# EAGLE design rf-power (EAGLE 6.2)
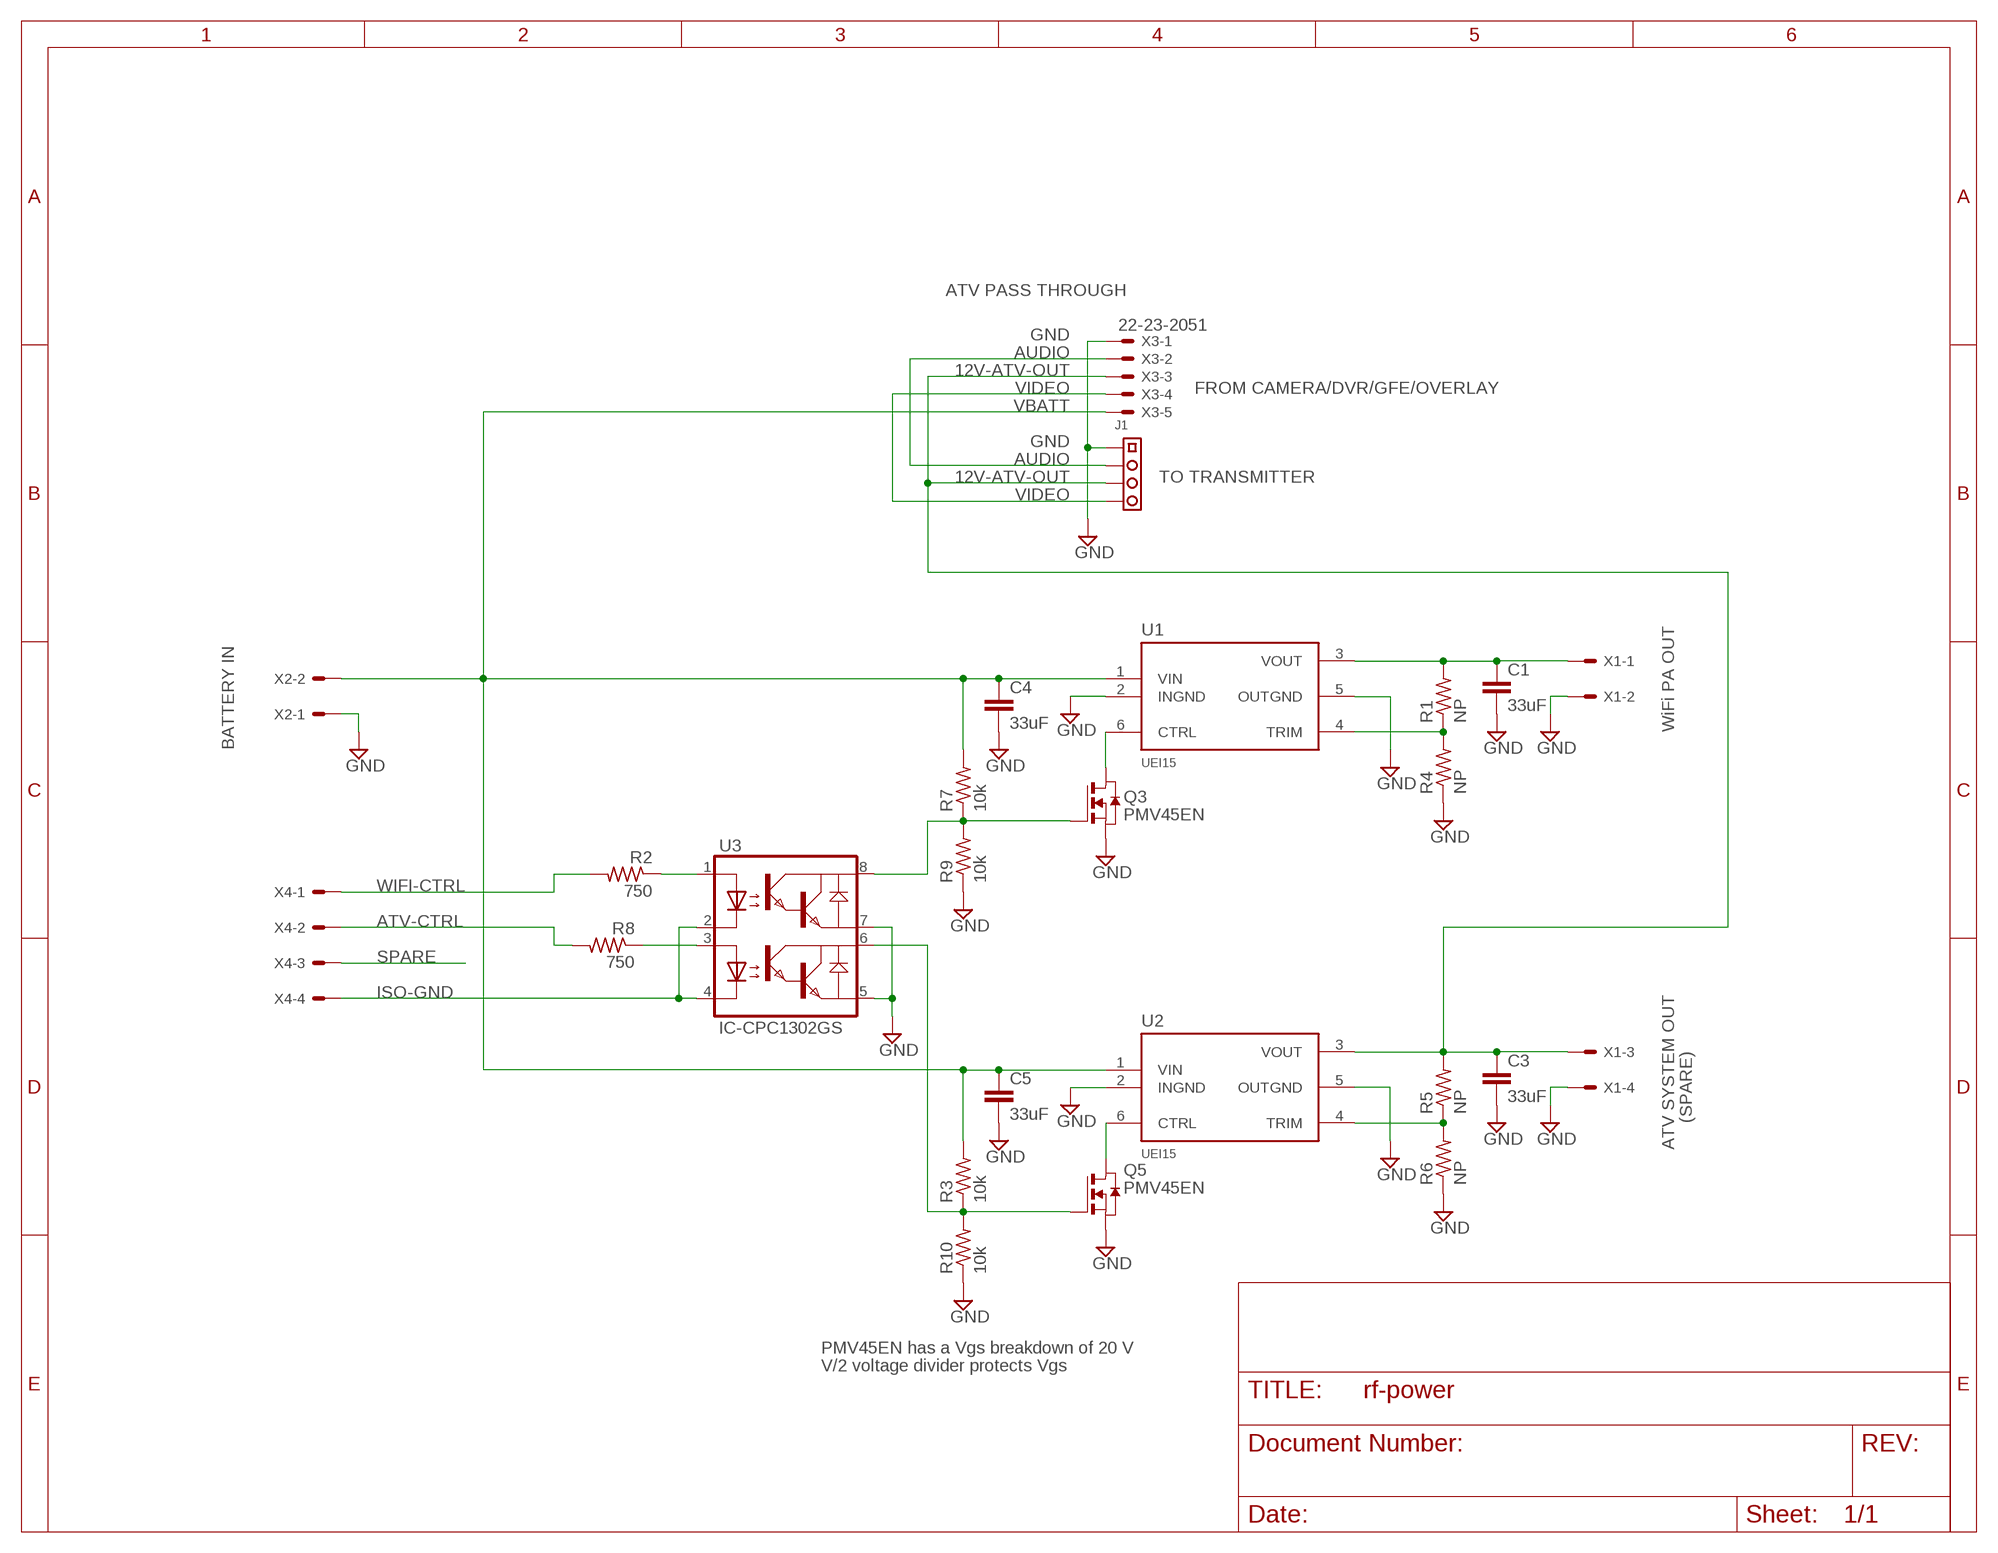
[diagram p0: schematic, sheet 1]

## Parts
C1  33uF  C-EU1206-B  [1206-B]
C3  33uF  C-EU1206-B  [1206-B]
C4  33uF  C-EU1206-B  [1206-B]
C5  33uF  C-EU1206-B  [1206-B]
J1  CON-2MM-4X1  [2MM-4X1]
Q3  PMV45EN  [SOT23]
Q5  PMV45EN  [SOT23]
R1  NP  R-US_0805-C-NOSILK  [0805-C-NOSILK]
R2  750  R-US_0805-C-NOSILK  [0805-C-NOSILK]
R3  10k  R-US_0805-C-NOSILK  [0805-C-NOSILK]
R4  NP  R-US_0805-C-NOSILK  [0805-C-NOSILK]
R5  NP  R-US_0805-C-NOSILK  [0805-C-NOSILK]
R6  NP  R-US_0805-C-NOSILK  [0805-C-NOSILK]
R7  10k  R-US_0805-C-NOSILK  [0805-C-NOSILK]
R8  750  R-US_0805-C-NOSILK  [0805-C-NOSILK]
R9  10k  R-US_0805-C-NOSILK  [0805-C-NOSILK]
R10  10k  R-US_0805-C-NOSILK  [0805-C-NOSILK]
U1  UEI15  [UEI15_PIN]
U2  UEI15  [UEI15_PIN]
U3  IC-CPC1302GS  [DIL-SMT-8]
X1  22-23-2041  [22-23-2041]
X2  22-23-2021  [22-23-2021]
X3  22-23-2051  [22-23-2051]
X4  22-23-2041  [22-23-2041]

## Nets
12V-ATV-OUT: C3.1 J1.3 R5.2 U2.3(VOUT) X1.3 X3.3
12V-WIFI-OUT: C1.1 R1.2 U1.3(VOUT) X1.1
ATV-CTRL: R8.2 X4.2
AUDIO: J1.2 X3.2
GND: C1.2 C3.2 C4.2 C5.2 J1.1 Q3.2(S) Q5.2(S) R4.1 R6.1 R9.1 R10.1 U1.2(INGND) U1.5(OUTGND) U2.2(INGND) U2.5(OUTGND) U3.5(E2) U3.7(E1) X1.2 X1.4 X2.1 X3.1
ISO-GND: U3.2(K1) U3.4(K2) X4.4
N$1: R8.1 U3.3(A2)
N$2: Q5.3(D) U2.6(CTRL)
N$3: R1.1 R4.2 U1.4(TRIM)
N$4: R5.1 R6.2 U2.4(TRIM)
N$5: Q3.3(D) U1.6(CTRL)
N$6: Q3.1(G) R7.1 R9.2 U3.8(C1)
N$7: R2.1 U3.1(A1)
N$8: Q5.1(G) R3.1 R10.2 U3.6(C2)
SPARE: X4.3
VBATT: C4.1 C5.1 R3.2 R7.2 U1.1(VIN) U2.1(VIN) X2.2 X3.5
VIDEO: J1.4 X3.4
WIFI-CTRL: R2.2 X4.1

## Notes on the sheet
- ATV PASS THROUGH
- FROM CAMERA/DVR/GFE/OVERLAY
- TO TRANSMITTER
- WiFi PA OUT
- BATTERY IN
- (SPARE)
- ATV SYSTEM OUT
- PMV45EN has a Vgs breakdown of 20 V
- V/2 voltage divider protects Vgs

## Library data of the parts
C1 C3-C5 = rcl_custom:C-EU: CAPACITOR, European symbol
J1 = 2mmx4:CON-2MM-4X1
Q3 Q5 = Tova:PMV45EN
R1-R10 = rcl_custom:R-US_: RESISTOR, American symbol
U1 U2 = UEI15:UEI15: Isolated Wide Input Range 15-Watt DC/DC Converter
U3 = Tova:IC-CPC1302GS
X1 X4 = con-molex:22-23-2041: .100" (2.54mm) Center Header - 4 Pin; MF: MOLEX; MPN: 22-23-2041; OC_FARNELL: 1462920; OC_NEWARK: 38C0355
X2 = con-molex:22-23-2021: .100" (2.54mm) Center Header - 2 Pin; MF: MOLEX; MPN: 22-23-2021; OC_FARNELL: 1462926; OC_NEWARK: 25C3832
X3 = con-molex:22-23-2051: .100" (2.54mm) Center Header - 5 Pin; MF: MOLEX; MPN: 22-23-2051; OC_FARNELL: 1462952; OC_NEWARK: 38C9178

## Board
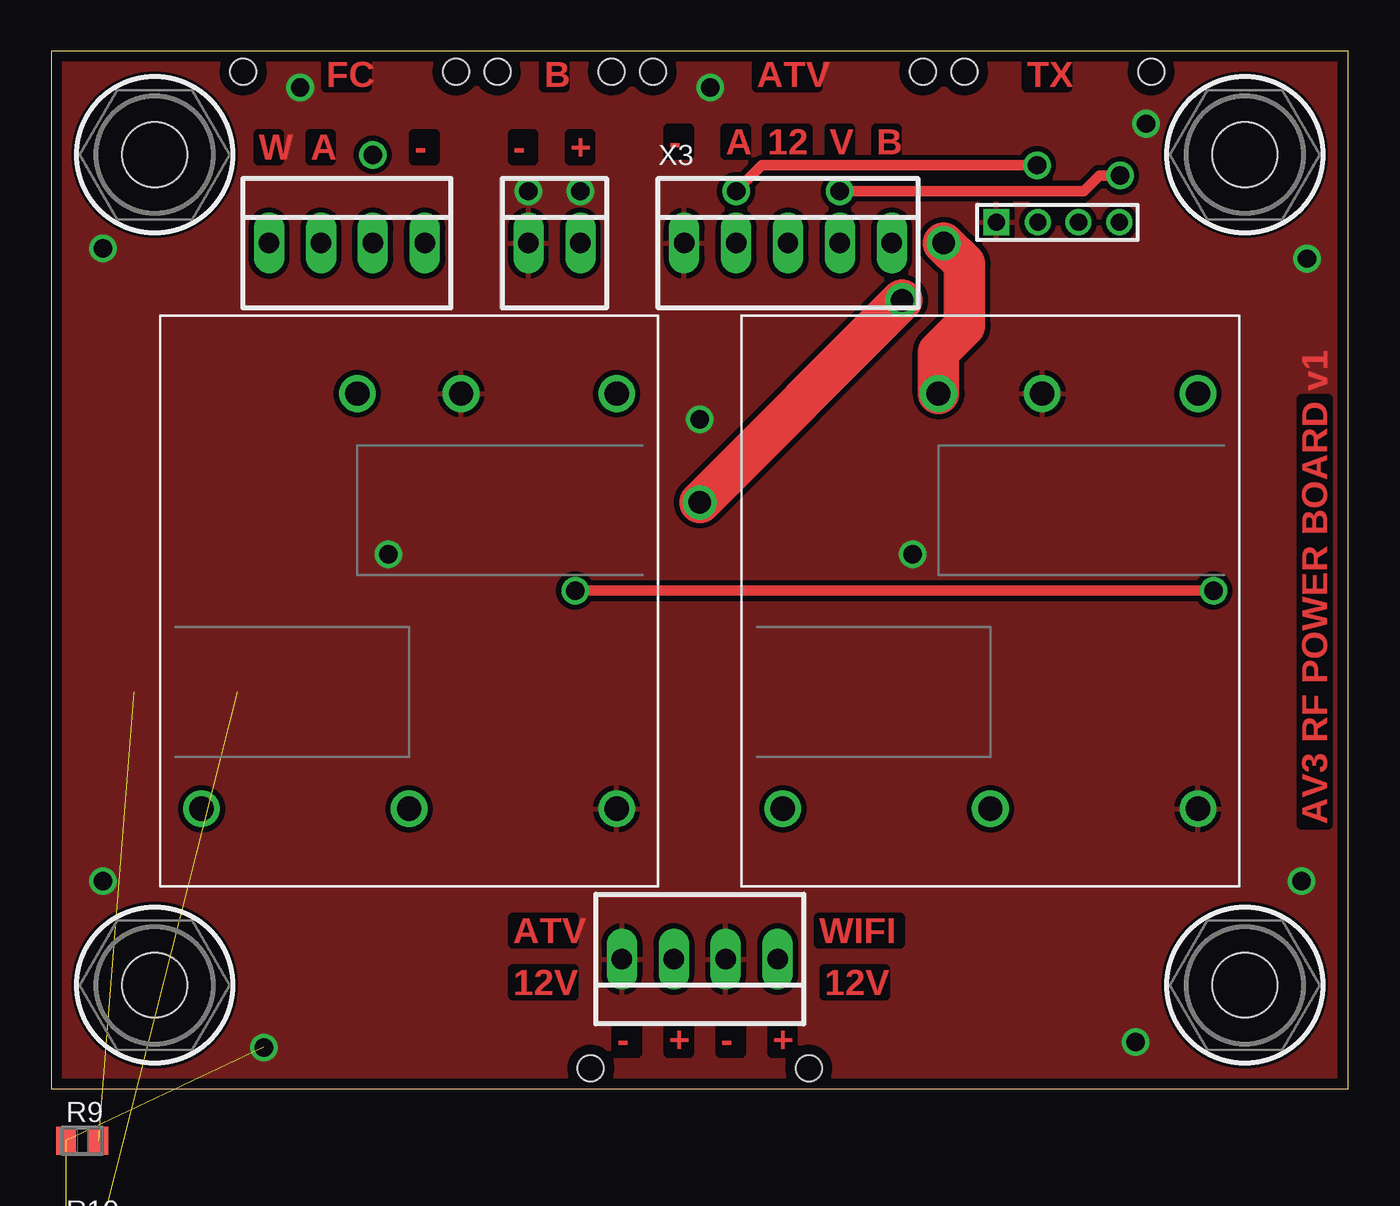
[diagram p1: board, top side]
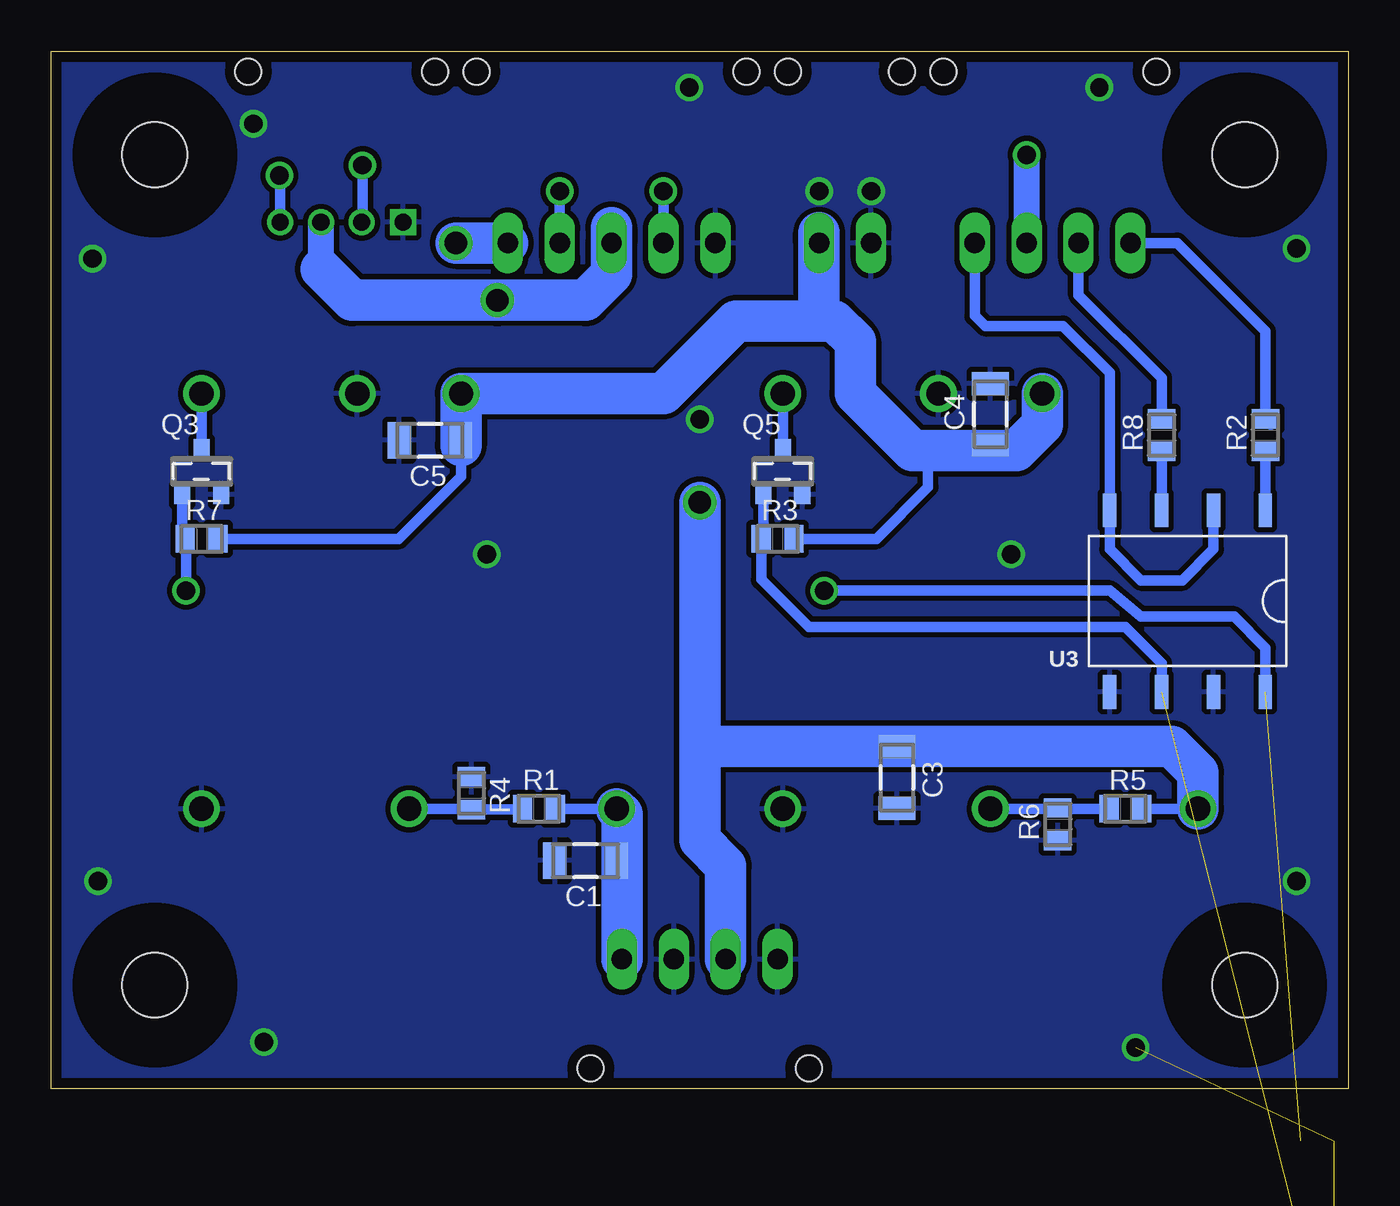
[diagram p2: board, bottom side, seen from below]

Size 63.5 x 50.8 mm. Coordinates in mm from the lower left corner, seen from the top.
Outline: 0,0 63.5,0 63.5,50.8 0,50.8 0,0
Copper layers (1*16): Top 0.0178mm / dielectric 59mil / Bottom 0.0178mm
Design rules: minimum track width 6mil, minimum drill 14mil, track to track 6mil, track to pad 6mil, pad to pad 6mil, via to via 6mil, smd to smd 6mil, copper to edge 20mil, drill to drill 16mil, minimum pad ring 8mil, minimum via ring 8mil, stop-mask expansion 3mil, vias tented up to drill 0mil, thermal gap 10mil
Holes 1.27 mm at 9.4,49.78 19.81,49.78 21.84,49.78 27.43,49.78 29.46,49.78 42.67,49.78 44.7,49.78 53.85,49.78 26.42,1.02 37.08,1.02
bRestrict: area 1.4,1.4 to 8.7,8.7; area 54.8,1.4 to 62.1,8.7; area 54.8,42.1 to 62.1,49.4; area 1.4,42.1 to 8.7,49.4

### Footprints (pad centres in the part's own frame; a part is rotated, then mirrored left to right if it is on the bottom)
1206-B = smd 1.15 x 1.8: 1 -1.5,0; 2 1.5,0
2MM-4X1 = drill 0.838 pad 1.27 square: 1 0,4.03 | drill 0.838 pad 1.27: 2 0,2; 3 0,0; 4 0,-2
SOT23 = smd 0.787 x 0.889: 1 -0.953,-1.143; 2 0.953,-1.143; 3 0,1.143
0805-C-NOSILK = smd 0.95 x 1.35: 1 -0.8,0; 2 0.8,0
UEI15_PIN = drill 1.194: 1 -10.16,-2.54; 2 -10.16,2.54; 3 10.16,-10.16; 4 10.16,0; 5 10.16,10.16; 6 -10.16,10.16
DIL-SMT-8 = smd 0.648 x 1.648: 1 -3.81,-4.449; 2 -1.27,-4.449; 3 1.27,-4.449; 4 3.81,-4.449; 5 3.81,4.449; 6 1.27,4.449; 7 -1.27,4.449; 8 -3.81,4.449
#4/.300-BARE+STD_NUT_OR_STAR_WASHER = hole 3.175: 0,0
22-23-2041 = drill 1 long: 1 -3.81,0; 2 -1.27,0; 3 1.27,0; 4 3.81,0
22-23-2021 = drill 1 long: 1 -1.27,0; 2 1.27,0
22-23-2051 = drill 1 long: 1 -5.08,0; 2 -2.54,0; 3 0,0; 4 2.54,0; 5 5.08,0

### Placement (x,y rotation side)
C1  37.34,11.18 180 bottom
C3  22.1,15.24 270 bottom
C4  17.53,33.02 90 bottom
C5  44.96,31.75 180 bottom
J1  50.29,42.42 90 top
Q3  56.13,30.23 0 bottom
Q5  27.69,30.23 0 bottom
R1  39.62,13.72 0 bottom
R2  4.06,32 90 bottom
R3  27.94,26.92 0 bottom
R4  42.93,14.48 270 bottom
R5  10.92,13.72 0 bottom
R6  14.22,12.95 90 bottom
R7  56.13,26.92 0 bottom
R8  9.14,32 90 bottom
R9  1.52,-2.54 0 top
R10  1.52,-7.37 0 top  (outside the outline)
U1  45.97,23.88 270 top
U2  17.53,23.88 270 top
U3  7.87,23.88 180 bottom
U$1  [#4/.300-BARE+STD_NUT_OR_STAR_WASHER]  5.08,45.72 0 top
U$2  [#4/.300-BARE+STD_NUT_OR_STAR_WASHER]  5.08,5.08 0 top
U$3  [#4/.300-BARE+STD_NUT_OR_STAR_WASHER]  58.42,5.08 0 top
U$4  [#4/.300-BARE+STD_NUT_OR_STAR_WASHER]  58.42,45.72 0 top
X1  31.75,6.35 180 top
X2  24.64,41.4 0 top
X3  36.07,41.4 0 top
X4  14.48,41.4 0 top

### Tracks (layer width: path | path; a pad name or v marks a point on that pad's centre or on a via)
12V-ATV-OUT  (via drill 1.1)
  Top 2.032: v31.75,28.7 v41.66,38.61
  Bottom 0.254: 7.11,13.72 U2.3 | C3.1 29.95,16.74 29.97,16.76
  Bottom 0.508: R5.2 U2.3
  Bottom 1.27: 50.29,40.13 J1.3
  Bottom 2.032: 31.75,16.51 31.75,12.19 30.48,10.92 X1.3 | 31.75,16.51 v31.75,28.7 | 50.29,40.13 48.77,38.61 v41.66,38.61 37.34,38.61 36.07,39.88 X3.3 36.07,42.16 | U2.3 7.37,15.49 8.64,16.76 29.97,16.76 31.5,16.76 31.75,16.51
12V-WIFI-OUT
  Bottom 0.254: 35.56,13.46 35.56,11.2 C1.1
  Bottom 0.508: R1.2 U1.3
  Bottom 2.032: X1.1 35.56,13.46 U1.3
ATV-CTRL
  Bottom 0.508: R8.2 9.14,34.8 13.21,38.86 X4.2
AUDIO  (via drill 0.9)
  Top 0.508: v48.26,45.21 34.8,45.21 v33.53,43.94
  Bottom 0.508: 33.56,43.91 v33.53,43.94 X3.2 | v48.26,45.21 48.26,42.45 J1.2
GND  (via drill 0.9, 0.9 pad 1.02)  (2 unrouted)
  other vias: 42.16,26.16 53.59,47.24 61.47,40.64 61.21,10.16 53.09,2.29 10.41,2.03 2.54,10.16 2.54,41.15 12.19,49.02 16.51,26.16 32.26,49.02 31.75,32.77 23.37,43.94 25.91,43.94
  pour Bottom (isolate 0.254): 0,0 0,50.8 63.5,50.8 63.5,0
  pour Top (isolate 0.254): 0,0 0,50.8 63.5,50.8 63.5,0
ISO-GND
  Bottom 0.508: X4.4 18.29,37.85 17.78,37.34 13.97,37.34 11.68,35.05 U3.4 11.68,26.42 10.16,24.89 8.13,24.89 6.6,26.42 U3.2
N$1
  Bottom 0.508: U3.3 R8.1
N$2
  Bottom 0.508: Q5.3 U2.6
N$3
  Bottom 0.254: 42.96,13.72 R4.2 | 40.46,13.68 R1.1
  Bottom 0.508: U1.4 42.96,13.72 | R4.2 40.46,13.68
N$4
  Bottom 0.254: 14.22,13.72 13.97,13.46 14.01,13.46 R6.2 14.19,13.72
  Bottom 0.508: U2.4 14.22,13.72 | R5.1 14.19,13.72
N$5
  Bottom 0.508: U1.6 Q3.3
N$6  (via drill 0.9)  (1 unrouted)
  Top 0.508: v25.65,24.38 v56.9,24.38
  Bottom 0.254: 57.09,27.08 R7.1
  Bottom 0.508: Q3.1 57.09,27.08 | U3.8 4.06,21.59 5.59,23.11 10.16,23.11 11.68,24.38 v25.65,24.38 | v56.9,24.38 56.9,26.89 R7.1
N$7
  Bottom 0.508: U3.1 R2.1
N$8  (1 unrouted)
  Bottom 0.254: 28.64,27.03 R3.1
  Bottom 0.508: Q5.1 28.64,27.03 | U3.6 9.14,20.83 10.92,22.61 26.42,22.61 28.74,24.93 R3.1
SPARE  (via drill 0.9 pad 0.9)
  Bottom 1.27: X4.3 v15.75,45.72
VBATT  (via drill 1.1)
  Top 2.032: U1.1 43.43,36.07 44.7,37.34 44.7,40.39 v43.69,41.4
  Bottom 0.254: C4.1 15.52,32.03 15.49,32 | 25.91,38.35 25.15,38.35 25.15,37.59 | 43.43,31.5 C5.1
  Bottom 0.508: R7.2 46.48,26.92 43.43,29.97 43.43,31.5 | R3.2 23.11,26.92 20.57,29.46 20.57,31.24
  Bottom 2.032: 25.91,38.35 X2.2 25.91,41.91 | U2.1 14.99,32.51 15.49,32 16.26,31.24 20.57,31.24 21.34,31.24 24.13,34.04 24.13,36.58 25.15,37.59 29.97,37.59 33.53,34.04 U1.1 43.43,31.5 | v43.69,41.4 X3.5
VIDEO  (via drill 0.9)
  Top 0.508: v52.32,44.7 51.31,44.7 50.55,43.94 v38.61,43.94
  Bottom 0.508: J1.4 52.29,43.97 v52.32,44.7 | X3.4 v38.61,43.94
WIFI-CTRL
  Bottom 0.508: 3.81,32.51 4.06,32.77 R2.2 4.06,37.08 8.38,41.4 X4.1

### Text on the board
Top: FC | B | ATV | TX | - | A | 12 | V | B | W | A | - | - | + | AV3 RF POWER BOARD v1 | ATV | WIFI | 12V | 12V | - | + | - | +